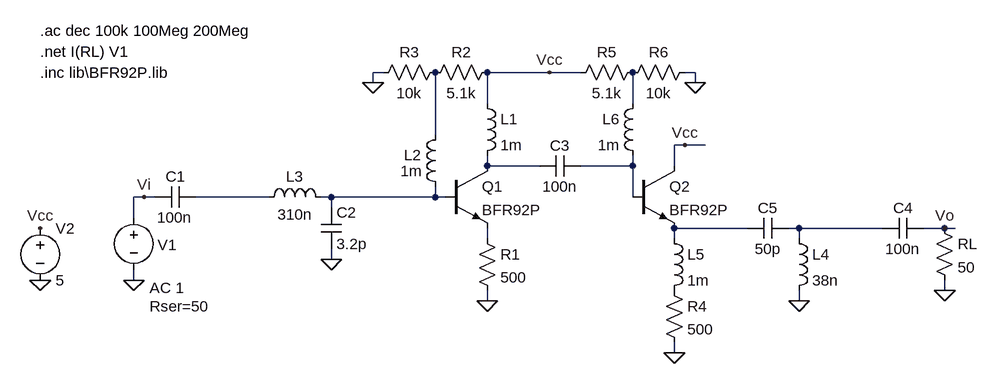
[diagram p0: schematic 2m_band_power_amp_fooling_around.asc]
2m_band_power_amp_fooling_around.asc, the LTspice schematic file:
Version 4.1
SHEET 1 1684 680
WIRE 768 192 752 192
WIRE 1024 192 928 192
WIRE 1072 192 1024 192
WIRE 1248 192 1232 192
WIRE 752 208 752 192
WIRE 1248 208 1248 192
WIRE 928 240 928 192
WIRE 1152 240 1152 192
WIRE 848 288 848 192
WIRE 1232 304 1216 304
WIRE 1264 304 1232 304
WIRE 928 336 928 320
WIRE 1008 336 928 336
WIRE 1152 336 1152 320
WIRE 1152 336 1072 336
WIRE 1216 336 1216 304
WIRE 400 384 384 384
WIRE 416 384 400 384
WIRE 592 384 480 384
WIRE 688 384 672 384
WIRE 848 384 848 368
WIRE 848 384 688 384
WIRE 864 384 848 384
WIRE 1152 384 1152 336
WIRE 688 400 688 384
WIRE 384 416 384 384
WIRE 1328 432 1216 432
WIRE 1408 432 1392 432
WIRE 1536 432 1408 432
WIRE 1632 432 1600 432
WIRE 1648 432 1632 432
WIRE 928 448 928 432
WIRE 1216 448 1216 432
WIRE 1408 448 1408 432
WIRE 688 480 688 464
WIRE 384 512 384 496
WIRE 1632 528 1632 512
WIRE 928 544 928 528
WIRE 1408 544 1408 528
WIRE 1216 624 1216 608
FLAG 384 512 0
FLAG 240 432 Vcc
FLAG 240 512 0
FLAG 1632 528 0
FLAG 1632 432 Vo
FLAG 400 384 Vi
FLAG 1024 192 Vcc
FLAG 752 208 0
FLAG 928 544 0
FLAG 1216 624 0
FLAG 688 480 0
FLAG 1408 544 0
FLAG 1248 208 0
FLAG 1232 304 Vcc
SYMBOL voltage 384 400 R0
WINDOW 123 24 124 Left 2
WINDOW 39 24 152 Left 2
WINDOW 0 37 58 Left 2
SYMATTR Value2 AC 1
SYMATTR SpiceLine Rser=50
SYMATTR InstName V1
SYMATTR Value ""
SYMBOL voltage 240 416 R0
WINDOW 123 0 0 Left 0
WINDOW 39 0 0 Left 0
SYMATTR InstName V2
SYMATTR Value 5
SYMBOL res 1616 416 R0
SYMATTR InstName RL
SYMATTR Value 50
SYMBOL cap 480 368 R90
WINDOW 0 0 32 VBottom 2
WINDOW 3 32 33 VTop 2
SYMATTR InstName C1
SYMATTR Value 100n
SYMBOL npn 864 336 R0
SYMATTR InstName Q1
SYMATTR Value BFR92P
SYMATTR Prefix X
SYMBOL res 912 432 R0
SYMATTR InstName R1
SYMATTR Value 500
SYMBOL ind 912 224 R0
SYMATTR InstName L1
SYMATTR Value 1m
SYMBOL res 944 176 R90
WINDOW 0 0 56 VBottom 2
WINDOW 3 32 56 VTop 2
SYMATTR InstName R2
SYMATTR Value 5.1k
SYMBOL res 864 176 R90
WINDOW 0 0 56 VBottom 2
WINDOW 3 32 56 VTop 2
SYMATTR InstName R3
SYMATTR Value 10k
SYMBOL ind 864 384 R180
WINDOW 0 37 65 Left 2
WINDOW 3 36 40 Left 2
SYMATTR InstName L2
SYMATTR Value 1m
SYMBOL cap 1072 320 R90
WINDOW 0 0 32 VBottom 2
WINDOW 3 32 32 VTop 2
SYMATTR InstName C3
SYMATTR Value 100n
SYMBOL npn 1152 336 R0
SYMATTR InstName Q2
SYMATTR Value BFR92P
SYMATTR Prefix X
SYMBOL ind 1168 224 M0
SYMATTR InstName L6
SYMATTR Value 1m
SYMBOL ind 1200 432 R0
SYMATTR InstName L5
SYMATTR Value 1m
SYMBOL cap 1600 416 R90
WINDOW 0 0 32 VBottom 2
WINDOW 3 32 32 VTop 2
SYMATTR InstName C4
SYMATTR Value 100n
SYMBOL res 1200 512 R0
SYMATTR InstName R4
SYMATTR Value 500
SYMBOL ind 576 400 R270
WINDOW 0 32 56 VTop 2
WINDOW 3 5 56 VBottom 2
SYMATTR InstName L3
SYMATTR Value 310n
SYMBOL cap 672 400 R0
SYMATTR InstName C2
SYMATTR Value 3.2p
SYMBOL cap 1392 416 R90
WINDOW 0 0 32 VBottom 2
WINDOW 3 32 32 VTop 2
SYMATTR InstName C5
SYMATTR Value 50p
SYMBOL ind 1392 432 R0
SYMATTR InstName L4
SYMATTR Value 38n
SYMBOL res 1168 176 R90
WINDOW 0 0 56 VBottom 2
WINDOW 3 32 56 VTop 2
SYMATTR InstName R5
SYMATTR Value 5.1k
SYMBOL res 1248 176 R90
WINDOW 0 0 56 VBottom 2
WINDOW 3 32 56 VTop 2
SYMATTR InstName R6
SYMATTR Value 10k
TEXT 240 128 Left 2 !.ac dec 100k 100Meg 200Meg
TEXT 240 160 Left 2 !.net I(RL) V1
TEXT 240 192 Left 2 !.inc lib\\BFR92P.lib

The netlist it stands for:
* 2m_band_power_amp_fooling_around.asc
V1 Vi 0 AC 1 Rser=50
V2 Vcc 0 5
RL Vo 0 50
C1 N005 Vi 100n
X§Q1 N003 N006 N009 BFR92P  ; pins C B E
R1 N009 0 500
L1 Vcc N003 1m
R2 Vcc N002 5.1k
R3 N002 0 10k
L2 N006 N002 1m
C3 N004 N003 100n
X§Q2 Vcc N004 N007 BFR92P  ; pins C B E
L6 N001 N004 1m
L5 N007 P001 1m
C4 Vo N008 100n
R4 P001 0 500
L3 N005 N006 310n
C2 N006 0 3.2p
C5 N008 N007 50p
L4 N008 0 38n
R5 N001 Vcc 5.1k
R6 0 N001 10k
.ac dec 100k 100Meg 200Meg
.net I(RL) V1
.inc lib\BFR92P.lib
.backanno
.end